# EAGLE design ciborg-1 (EAGLE 4.13)
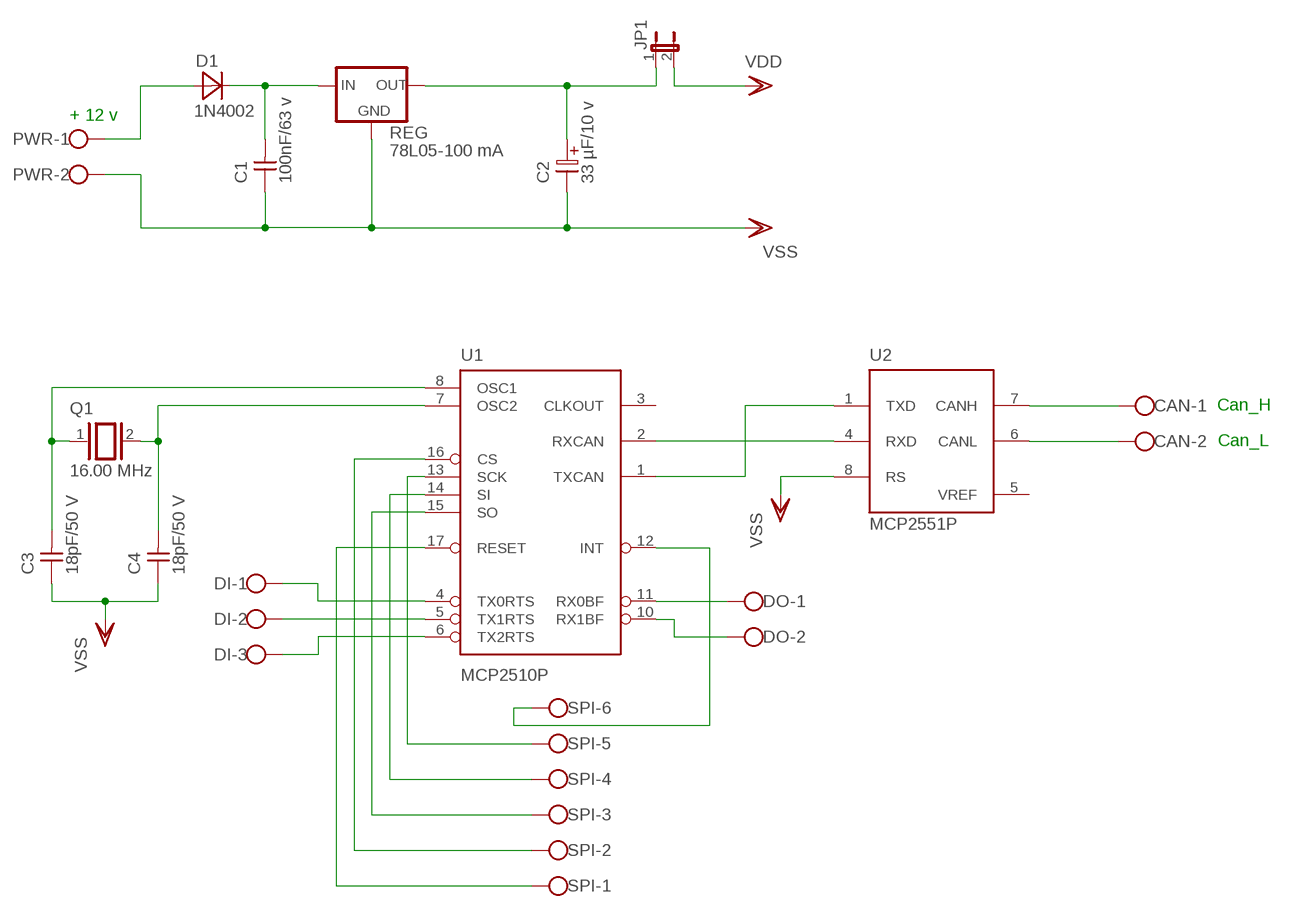
[diagram p0: schematic, sheet 1]

## Parts
C1  100nF/63 v  CAPNP-5  [C-5]
C2  33 µF/10 v  ELC-2,5L  [ES-2,5L]
C3  18pF/50 V  CAPNP-5  [C-5]
C4  18pF/50 V  CAPNP-5  [C-5]
CAN  AK550/2  [AK550/2]
D1  1N4002  DIODE-10  [D-10]
DI  AK550/3  [AK550/3]
DO  AK550/2  [AK550/2]
JP1  JP1E  [JP1]
PWR  AK550/2  [AK550/2]
Q1  16.00 MHz  XTAL/S  [QS]
REG  78L05-100 mA  78LXX  [78LXX]
SPI  AK550/6  [AK550/6]
U1  MCP2510P  [DIL18]
U2  MCP2551P  [DIL8]

## Nets
CANH: CAN.1 U2.7(CANH)
CANL: CAN.2 U2.6(CANL)
N$1: D1.1(A) PWR.1
N$2: C2.1 JP1.1 REG.OUT
N$3: C4.2 Q1.2 U1.7(OSC2)
N$4: SPI.5 U1.13(SCK)
N$5: SPI.4 U1.14(SI)
N$6: C3.2 Q1.1 U1.8(OSC1)
N$7: C1.2 D1.2(K) REG.IN
N$8: SPI.6 U1.12(INT)
N$9: SPI.3 U1.15(SO)
N$10: SPI.2 U1.16(CS)
N$11: SPI.1 U1.17(RESET)
N$12: U1.2(RXCAN) U2.4(RXD)
N$13: U1.1(TXCAN) U2.1(TXD)
N$14: DI.1 U1.4(TX0RTS)
N$15: DI.2 U1.5(TX1RTS)
N$16: DI.3 U1.6(TX2RTS)
N$17: DO.1 U1.11(RX0BF)
N$18: DO.2 U1.10(RX1BF)
VDD: JP1.2
VSS: C1.1 C2.2 C3.1 C4.1 PWR.2 REG.GND U2.8(RS)
Unconnected: U1.3(CLKOUT)

## Notes on the sheet
- + 12 v
- Can_H
- Can_L

## Power pins joined to a net without a drawn wire
VDD: U1.18(VDD) U2.3(VDD)
VREF: U2.5(VREF)
VSS: U1.9(VSS) U2.2(VSS)

## Library data of the parts
C1 C3 C4 = discrete:CAPNP-5
C2 = discrete:ELC-2,5L
CAN DO PWR = con-ptr500+:AK550/2: CONNECTOR
D1 = discrete:DIODE-10
DI = con-ptr500+:AK550/3: CONNECTOR
JP1 = jumper:JP1E: JUMPER
Q1 = special:XTAL/S: CRYSTAL
REG = v-reg:78LXX: VOLTAGE REGULATOR
SPI = con-ptr500+:AK550/6: CONNECTOR
U1 = microchip_can:MCP2510
U2 = microchip_can:MCP2551: High Speed CAN tranceiver

## Board
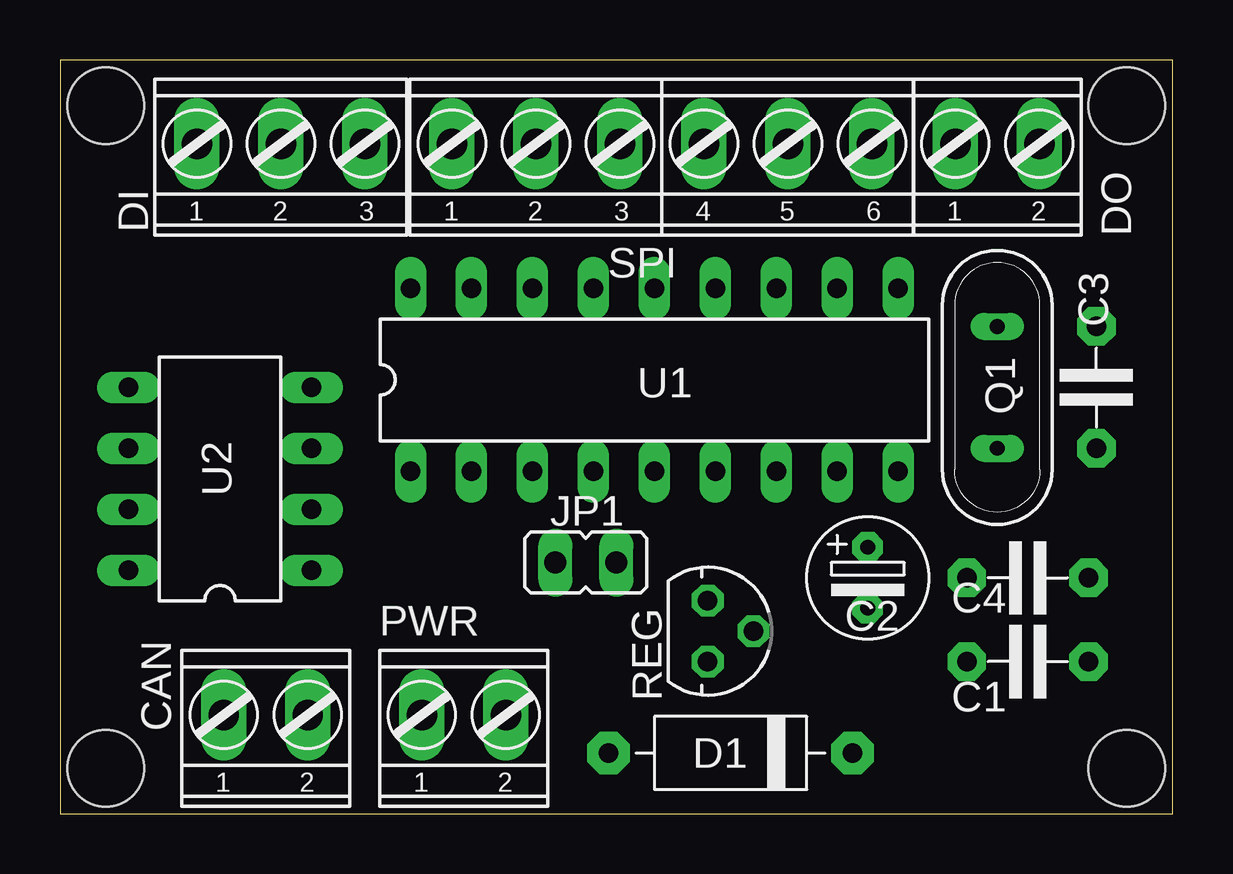
[diagram p1: board, top side]
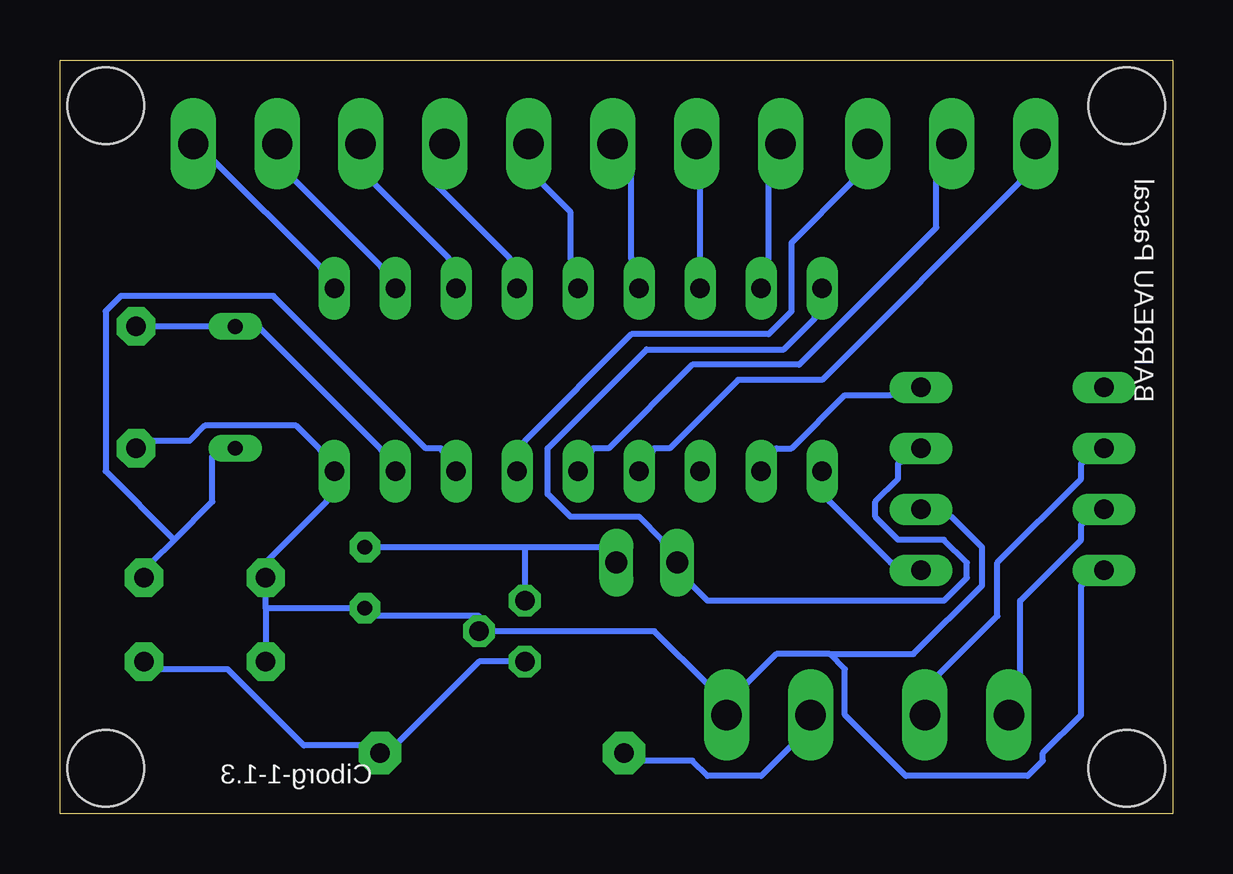
[diagram p2: board, bottom side, seen from below]

Size 46.35 x 31.43 mm. Coordinates in mm from the lower left corner, seen from the top.
Outline: 0,0 46.35,0 46.35,31.43 0,31.43 0,0
Copper layers (1*16): Top 0.0356mm / dielectric 1.5011mm / Bottom 0.0356mm
Design rules "pcbshop": minimum track width 10mil, minimum drill 18mil, track to track 10mil, track to pad 10mil, pad to pad 8mil, via to via 10mil, smd to smd 8mil, copper to edge 40mil, drill to drill 10mil, minimum pad ring 10mil, minimum via ring 8mil, stop-mask expansion 4mil, vias tented up to drill 0mil, thermal gap 10mil
Holes 3.2 mm at 1.91,29.53 44.45,29.53 44.45,1.91 1.91,1.91

### Footprints (pad centres in the part's own frame; a part is rotated, then mirrored left to right if it is on the bottom)
C-5 = drill 0.813 pad 1.6 octagon: 1 -2.54,0; 2 2.54,0
ES-2,5L = drill 0.61 pad 1.27 octagon: 1 0,0; 2 2.54,0
AK550/2 = drill 1.27 long: 1 -1.75,0; 2 1.75,0
D-10 = drill 0.813 pad 1.778 octagon: 1 -5.08,0; 2 5.08,0
AK550/3 = drill 1.27 long: 1 -3.5,0; 2 0,0; 3 3.5,0
JP1 = drill 0.914 long: 1 0,-1.27; 2 0,1.27
QS = drill 0.61 long: 1 -2.54,0; 2 2.54,0
78LXX = drill 0.813 octagon: GND 0,1.905; IN 1.27,0; OUT -1.27,0
AK550/6 = drill 1.27 long: 1 -8.75,0; 2 -5.25,0; 3 -1.75,0; 4 1.75,0; 5 5.25,0; 6 8.75,0
DIL18 = drill 0.813 long: 1 -10.16,-3.81; 2 -7.62,-3.81; 3 -5.08,-3.81; 4 -2.54,-3.81; 5 0,-3.81; 6 2.54,-3.81; 7 5.08,-3.81; 8 7.62,-3.81; 9 10.16,-3.81; 10 10.16,3.81; 11 7.62,3.81; 12 5.08,3.81; 13 2.54,3.81; 14 0,3.81; 15 -2.54,3.81; 16 -5.08,3.81; 17 -7.62,3.81; 18 -10.16,3.81
DIL8 = drill 0.813 long: 1 -3.81,-3.81; 2 -1.27,-3.81; 3 1.27,-3.81; 4 3.81,-3.81; 5 3.81,3.81; 6 1.27,3.81; 7 -1.27,3.81; 8 -3.81,3.81

### Placement (x,y rotation side)
C1  40.32,6.35 0 top
C2  33.66,11.11 270 top
C3  43.18,17.78 90 top
C4  40.32,9.84 0 top
CAN  8.57,4.13 0 top
D1  27.94,2.54 0 top
DI  9.21,27.94 0 top
DO  39.05,27.94 0 top
JP1  21.91,10.48 90 top
PWR  16.83,4.13 0 top
Q1  39.05,17.78 270 top
REG  26.99,7.62 270 top
SPI  25.08,27.94 0 top
U1  24.77,18.1 0 top
U2  6.67,13.97 90 top

### Tracks (layer width: path | path; a pad name or v marks a point on that pad's centre or on a via)
CANH
  Bottom 0.254: U2.7 3.81,12.06 3.81,11.43 6.35,8.89 6.35,5.71 CAN.1
CANL
  Bottom 0.254: U2.6 3.81,14.61 3.81,13.97 7.3,10.48 7.3,8.26 9.84,5.71 CAN.2
N$1
  Bottom 0.254: D1.1 22.23,2.22 20,2.22 19.37,1.59 17.14,1.59 15.88,2.86 PWR.1
N$2
  Bottom 0.254: 26.99,11.11 23.81,11.11 JP1.1 | 26.99,11.11 C2.1 | 26.99,11.11 REG.OUT
N$3
  Bottom 0.254: 41.59,11.43 42.55,10.48 C4.2 | 41.59,11.43 40.01,13.02 40.01,14.92 Q1.2 | 41.59,11.43 44.45,14.29 44.45,20.95 43.81,21.59 37.47,21.59 31.11,15.24 30.48,15.24 U1.7
N$4
  Bottom 0.254: U1.13 27.62,23.18 30.8,26.35 SPI.5
N$5
  Bottom 0.254: U1.14 25.08,23.18 25.08,25.08 26.35,26.35 SPI.4
N$6
  Bottom 0.254: C3.2 Q1.1 38.1,20.32 33.02,15.24 U1.8
N$7
  Bottom 0.254: REG.IN 28.89,6.35 32.38,2.86 D1.2 33.66,2.86 36.2,2.86 39.37,6.03 42.23,6.03 C1.2
N$8
  Bottom 0.254: U1.12 30.16,23.18 33.34,26.35 SPI.6
N$9
  Bottom 0.254: U1.15 22.54,23.18 22.54,26.67 SPI.3
N$10
  Bottom 0.254: U1.16 19.68,26.35 SPI.2
N$11
  Bottom 0.254: U1.17 16.83,23.18 16.83,26.35 SPI.1
N$12
  Bottom 0.254: U1.2 16.51,15.24 15.88,15.24 13.65,17.46 11.75,17.46 U2.4
N$13
  Bottom 0.254: U2.1 11.75,10.48 14.29,13.02 U1.1
N$14
  Bottom 0.254: U1.4 21.59,15.24 20.95,15.24 18.1,18.1 14.61,18.1 6.35,26.35 DI.1
N$15
  Bottom 0.254: U1.5 24.13,15.24 23.5,15.24 20,18.73 15.56,18.73 9.84,24.45 9.84,26.35 DI.2
N$16
  Bottom 0.254: U1.6 26.99,15.56 22.54,20 16.83,20 15.88,20.95 15.88,23.81 13.34,26.35 DI.3
N$17
  Bottom 0.254: U1.11 33.02,22.86 36.83,26.67 DO.1
N$18
  Bottom 0.254: U1.10 35.56,22.86 40.01,27.3 DO.2
VDD
  Bottom 0.254: U2.3 11.43,14.61 11.43,13.97 12.38,13.02 12.38,12.38 11.43,11.43 9.53,11.43 8.57,10.48 8.57,9.84 9.53,8.89 19.37,8.89 20,9.53 JP1.2 21.27,11.43 22.23,12.38 25.08,12.38 26.04,13.34 26.04,15.24 21.91,19.37 16.19,19.37 14.92,20.64 U1.18
VSS
  Bottom 0.254: 37.78,8.57 C1.1 | 37.78,8.57 C4.1 37.78,10.48 35.24,13.02 U1.9 35.56,15.24 36.51,16.19 40.32,16.19 40.96,15.56 42.55,15.56 C3.1 | 37.78,8.57 C2.2 33.34,8.26 28.89,8.26 REG.GND 21.59,7.62 19.37,5.4 PWR.2 17.78,5.4 16.51,6.67 14.29,6.67 | 14.29,6.67 13.65,6.03 13.65,4.13 11.11,1.59 6.03,1.59 5.4,2.22 5.4,2.54 3.81,4.13 3.81,9.53 U2.8 | 14.29,6.67 10.79,6.67 7.94,9.53 7.94,11.11 9.21,12.38 U2.2

### Text on the board
bNames: BARREAU Pascal | Ciborg-1-1.3